# EAGLE design 8xEUCLID (EAGLE 9.4.1)
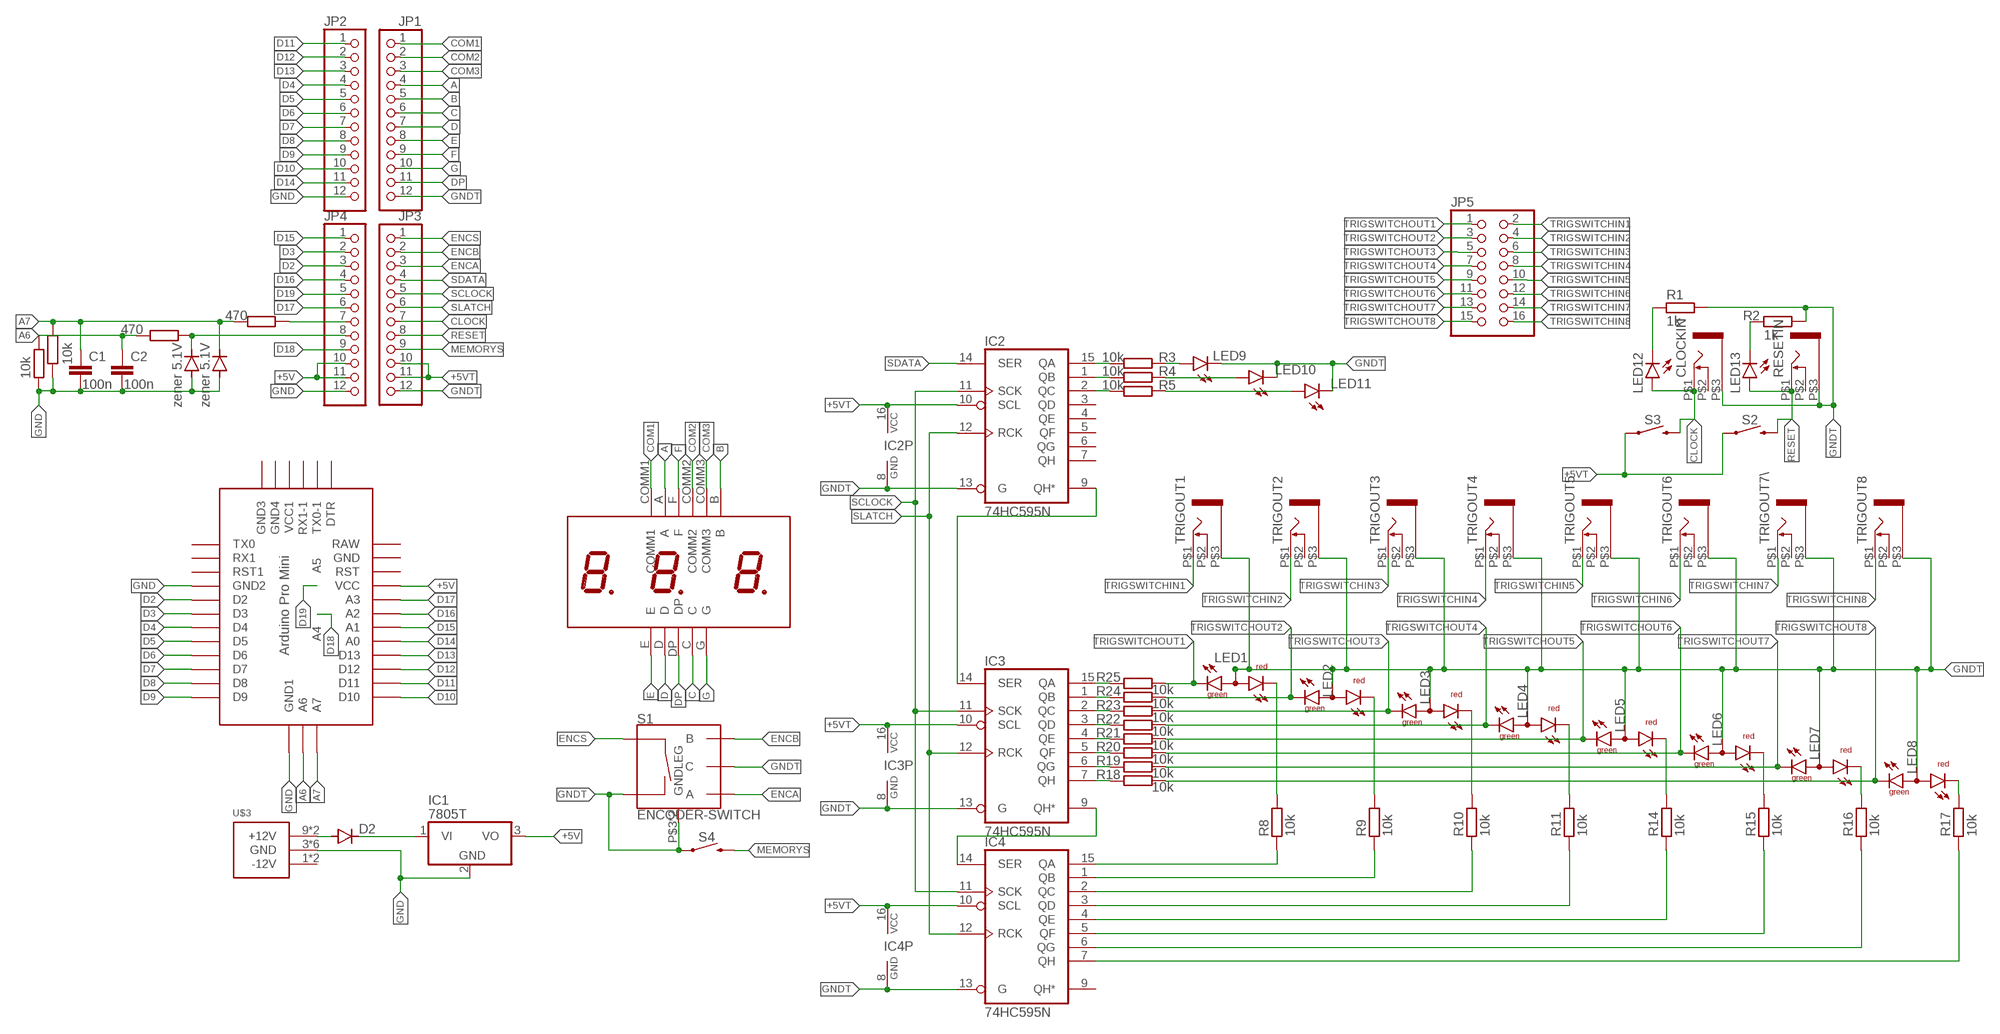
[diagram p0: schematic, sheet 1]

## Parts
C1  100n  C-EU025-025X050  [C025-025X050]
C2  100n  C-EU025-025X050  [C025-025X050]
CLOCKIN  WQP-PJ301M-12_JACK  [WQP-PJ301M-12_JACK]
D1  zener 5.1V  BAV21  [DO35-10]
D2  1N4004  [DO41-10]
D3  zener 5.1V  BAV21  [DO35-10]
IC1  7805T  [TO220H]
IC2  74HC595N  [DIL16]
IC3  74HC595N  [DIL16]
IC4  74HC595N  [DIL16]
JP1  PINHD-1X12-CB  [1X12-CB]
JP2  PINHD-1X12-CB  [1X12-CB]
JP3  PINHD-1X12-CB  [1X12-CB]
JP4  PINHD-1X12-CB  [1X12-CB]
JP5  PINHD-2X8  [2X08]
LED1  L-115WEGW-CA  [DUOLED-A-3MM]
LED2  L-115WEGW-CA  [DUOLED-A-3MM]
LED3  L-115WEGW-CA  [DUOLED-A-3MM]
LED4  L-115WEGW-CA  [DUOLED-A-3MM]
LED5  L-115WEGW-CA  [DUOLED-A-3MM]
LED6  L-115WEGW-CA  [DUOLED-A-3MM]
LED7  L-115WEGW-CA  [DUOLED-A-3MM]
LED8  L-115WEGW-CA  [DUOLED-A-3MM]
LED9  LED3MM  [LED3MM]
LED10  LED3MM  [LED3MM]
LED11  LED3MM  [LED3MM]
LED12  LED5MM  [LED5MM]
LED13  LED5MM  [LED5MM]
R1  1k  R-EU_0204/2V  [0204V]
R2  1k  R-EU_0204/2V  [0204V]
R3  10k  R-EU_0204/2V  [0204V]
R4  10k  R-EU_0204/2V  [0204V]
R5  10k  R-EU_0204/2V  [0204V]
R6  10k  R-EU_0204/7  [0204/7]
R7  10k  R-EU_0204/7  [0204/7]
R8  10k  R-EU_0204/2V  [0204V]
R9  10k  R-EU_0204/2V  [0204V]
R10  10k  R-EU_0204/2V  [0204V]
R11  10k  R-EU_0204/2V  [0204V]
R12  470  R-EU_0204/7  [0204/7]
R13  470  R-EU_0204/7  [0204/7]
R14  10k  R-EU_0204/2V  [0204V]
R15  10k  R-EU_0204/2V  [0204V]
R16  10k  R-EU_0204/2V  [0204V]
R17  10k  R-EU_0204/2V  [0204V]
R18  10k  R-EU_0204/2V  [0204V]
R19  10k  R-EU_0204/2V  [0204V]
R20  10k  R-EU_0204/2V  [0204V]
R21  10k  R-EU_0204/2V  [0204V]
R22  10k  R-EU_0204/2V  [0204V]
R23  10k  R-EU_0204/2V  [0204V]
R24  10k  R-EU_0204/2V  [0204V]
R25  10k  R-EU_0204/2V  [0204V]
RESETIN  WQP-PJ301M-12_JACK  [WQP-PJ301M-12_JACK]
S1  ENCODER-SWITCH  [ROTARY_ENC_PLAIN]
S2  MOMENTARY-SWITCH-SPST-PTH-6.0MM  [TACTILE_SWITCH_PTH_6.0MM]
S3  MOMENTARY-SWITCH-SPST-PTH-6.0MM  [TACTILE_SWITCH_PTH_6.0MM]
S4  MOMENTARY-SWITCH-SPST-PTH-6.0MM  [TACTILE_SWITCH_PTH_6.0MM]
TRIGOUT1  WQP-PJ301M-12_JACK  [WQP-PJ301M-12_JACK]
TRIGOUT2  WQP-PJ301M-12_JACK  [WQP-PJ301M-12_JACK]
TRIGOUT3  WQP-PJ301M-12_JACK  [WQP-PJ301M-12_JACK]
TRIGOUT4  WQP-PJ301M-12_JACK  [WQP-PJ301M-12_JACK]
TRIGOUT5  WQP-PJ301M-12_JACK  [WQP-PJ301M-12_JACK]
TRIGOUT6  WQP-PJ301M-12_JACK  [WQP-PJ301M-12_JACK]
TRIGOUT7\  WQP-PJ301M-12_JACK  [WQP-PJ301M-12_JACK]
TRIGOUT8  WQP-PJ301M-12_JACK  [WQP-PJ301M-12_JACK]
U$1  3DIGIT_SEVENSEGMENT  [3DIG_SEVSEG]
U$2  ABK-PRO-MINI  [ABK-PRO-MINI]
U$3  POWER_SIMPLE10  [POWER_10]

## Nets
+5V: IC1.3(VO) JP4.10 JP4.11 U$2.VCC
+5VT: IC2.10(SCL) IC2.16(VCC) IC3.10(SCL) IC3.16(VCC) IC4.10(SCL) IC4.16(VCC) JP3.10 JP3.11 S2.1 S3.1
A: JP1.4 U$1.A
A6: C2.1 R6.1 R12.2 U$2.A6
A7: C1.1 D3.C R7.1 R13.2 U$2.A7
B: JP1.5 U$1.B
C: JP1.6 U$1.C
CLOCK: CLOCKIN.P$1 JP3.7 LED12.A S3.3
COM1: JP1.1 U$1.COMM1
COM2: JP1.2 U$1.COMM2
COM3: JP1.3 U$1.COMM3
D: JP1.7 U$1.D
D2: JP4.3 U$2.D2
D3: JP4.2 U$2.D3
D4: JP2.4 U$2.D4
D5: JP2.5 U$2.D5
D6: JP2.6 U$2.D6
D7: JP2.7 U$2.D7
D8: JP2.8 U$2.D8
D9: JP2.9 U$2.D9
D10: JP2.10 U$2.D10
D11: JP2.1 U$2.D11
D12: JP2.2 U$2.D12
D13: JP2.3 U$2.D13
D14: JP2.11 U$2.A0
D15: JP4.1 U$2.A1
D16: JP4.4 U$2.A2
D17: JP4.6 U$2.A3
D18: JP4.9 U$2.A4
D19: JP4.5 U$2.A5
DP: JP1.11 U$1.DP
E: JP1.8 U$1.E
ENCA: JP3.3 S1.A
ENCB: JP3.2 S1.B
ENCS: JP3.1 S1.SW+
F: JP1.9 U$1.F
G: JP1.10 U$1.G
GND: C1.2 C2.2 D1.A D3.A IC1.2(GND) JP2.12 JP4.12 R6.2 R7.2 U$2.GND1(GND2) U$2.GND4(GND1) U$3.3(GND) U$3.4(GND) U$3.5(GND) U$3.6(GND) U$3.7(GND) U$3.8(GND)
GNDT: CLOCKIN.P$3 IC2.8(GND) IC2.13(G) IC3.8(GND) IC3.13(G) IC4.8(GND) IC4.13(G) JP1.12 JP3.12 LED1.2(A) LED2.2(A) LED3.2(A) LED4.2(A) LED5.2(A) LED6.2(A) LED7.2(A) LED8.2(A) LED9.K(C) LED10.K(C) LED11.K(C) R1.2 R2.2 RESETIN.P$3 S1.C S1.P$3(GNDLEG) S1.P$4(GNDLEG) S1.SW- S4.1 TRIGOUT1.P$3 TRIGOUT2.P$3 TRIGOUT3.P$3 TRIGOUT4.P$3 TRIGOUT5.P$3 TRIGOUT6.P$3 TRIGOUT7\.P$3 TRIGOUT8.P$3
MEMORYS: JP3.9 S4.3
N$1: IC2.9(QH*) IC3.14(SER)
N$2: IC3.9(QH*) IC4.14(SER)
N$3: JP4.7 R13.1
N$4: D1.C JP4.8 R12.1
N$5: D2.A U$3.9(+12V) U$3.10(+12V)
N$6: LED8.3(CR) R17.2
N$7: IC3.7(QH) R18.1
N$8: LED7.3(CR) R16.2
N$9: D2.C IC1.1(VI)
N$10: IC3.6(QG) R19.1
N$11: IC3.5(QF) R20.1
N$12: IC3.4(QE) R21.1
N$13: IC4.15(QA) R8.1
N$14: IC4.1(QB) R9.1
N$15: IC4.2(QC) R10.1
N$16: IC4.3(QD) R11.1
N$17: IC4.4(QE) R14.1
N$18: IC4.5(QF) R15.1
N$19: IC4.6(QG) R16.1
N$20: IC4.7(QH) R17.1
N$21: IC2.15(QA) R3.1
N$22: IC2.1(QB) R4.1
N$23: IC2.2(QC) R5.1
N$24: IC3.3(QD) R22.1
N$25: LED6.3(CR) R15.2
N$26: IC3.2(QC) R23.1
N$27: IC3.1(QB) R24.1
N$28: LED12.K(C) R1.1
N$29: IC3.15(QA) R25.1
N$37: LED13.K(C) R2.1
N$38: LED9.A R3.2
N$39: LED10.A R4.2
N$40: LED11.A R5.2
N$41: LED5.3(CR) R14.2
N$42: LED4.3(CR) R11.2
N$43: LED3.3(CR) R10.2
N$44: LED2.3(CR) R9.2
N$45: LED1.3(CR) R8.2
RESET: JP3.8 LED13.A RESETIN.P$1 S2.3
SCLOCK: IC2.11(SCK) IC3.11(SCK) IC4.11(SCK) JP3.5
SDATA: IC2.14(SER) JP3.4
SLATCH: IC2.12(RCK) IC3.12(RCK) IC4.12(RCK) JP3.6
TRIGSWITCHIN1: JP5.2 TRIGOUT1.P$1
TRIGSWITCHIN2: JP5.4 TRIGOUT2.P$1
TRIGSWITCHIN3: JP5.6 TRIGOUT3.P$1
TRIGSWITCHIN4: JP5.8 TRIGOUT4.P$1
TRIGSWITCHIN5: JP5.10 TRIGOUT5.P$1
TRIGSWITCHIN6: JP5.12 TRIGOUT6.P$1
TRIGSWITCHIN7: JP5.14 TRIGOUT7\.P$1
TRIGSWITCHIN8: JP5.16 TRIGOUT8.P$1
TRIGSWITCHOUT1: JP5.1 LED1.1(CG) R25.2
TRIGSWITCHOUT2: JP5.3 LED2.1(CG) R24.2
TRIGSWITCHOUT3: JP5.5 LED3.1(CG) R23.2
TRIGSWITCHOUT4: JP5.7 LED4.1(CG) R22.2
TRIGSWITCHOUT5: JP5.9 LED5.1(CG) R21.2
TRIGSWITCHOUT6: JP5.11 LED6.1(CG) R20.2
TRIGSWITCHOUT7: JP5.13 LED7.1(CG) R19.2
TRIGSWITCHOUT8: JP5.15 LED8.1(CG) R18.2
Unconnected: CLOCKIN.P$2 IC2.3(QD) IC2.4(QE) IC2.5(QF) IC2.6(QG) IC2.7(QH) IC4.9(QH*) RESETIN.P$2 TRIGOUT1.P$2 TRIGOUT2.P$2 TRIGOUT3.P$2 TRIGOUT4.P$2 TRIGOUT5.P$2 TRIGOUT6.P$2 TRIGOUT7\.P$2 TRIGOUT8.P$2 U$2.DTR U$2.GND U$2.GND2(GND3) U$2.GND3(GND4) U$2.RAW U$2.RST U$2.RST1 U$2.RX1 U$2.RX1-1 U$2.TX0 U$2.TX0-1 U$2.VCC1 U$3.1(-12V) U$3.2(-12V)

## Library data of the parts
C1 C2 = resistor:C-EU: CAPACITOR, European symbol
CLOCKIN RESETIN TRIGOUT1-TRIGOUT6 TRIGOUT7\ TRIGOUT8 = thonkiconn:WQP-PJ301M-12_JACK
D1 D3 = diode:BAV21: DIODE high-voltage general purpose diode
D2 = diode:1N4004: DIODE general purpose rectifier, 1 A
IC1 = adafruit:78*: Positive VOLTAGE REGULATOR Added bigger pads to the TO-92 package
IC2-IC4 = 74xx-eu:74*595: 8-bit SHIFT REGISTER, output latch
JP1-JP4 = adafruit:PINHD-1X12: PIN HEADER
JP5 = pinhead:PINHD-2X8: PIN HEADER
LED1-LED8 = led:L-115WEGW-CA: T-1(3mm) BI-COLOR INDICATOR LAMP Source: Kingbright .. 2_colour_led_.pdf
LED9-LED13 = led:LED: LED OSRAM: - CHIPLED LG R971, LG N971, LY N971, LG Q971, LY Q971, LO R971, LY R971 LH N974, LH R974 LS Q976, LO Q976, LY Q976 LO Q996 - Hyper CHIPLED LW Q18S LB Q993, LB Q99A, LB R99A - SideLED LS A670, LO A670, LY A670, LG A670, LP A670 LB A673, LV A673, LT A673, LW A673 LH A674 LY A675 LS A676, LA A676, LO A676, LY A676, LW A676 LS A679, LY A679, LG A679 - Hyper Micro SIDELED® LS Y876, LA Y876, LO Y876, LY Y876 LT Y87S - SmartLED LW L88C, LW L88S LB L89C, LB L89S, LG L890 LS L89K, LO L89K, LY L89K LS L896, LA L896, LO L896, LY L896 - TOPLED LS T670, LO T670, LY T670, LG T670, LP T670 LSG T670, LSP T670, LSY T670, LOP T670, LYG T670 LG T671, LOG T671, LSG T671 LB T673, LV T673, LT T673, LW T673 LH T674 LS T676, LA T676, LO T676, LY T676, LB T676, LH T676, LSB T676, LW T676 LB T67C, LV T67C, LT T67C, LS T67K, LO T67K, LY T67K, LW E67C LS E67B, LA E67B, LO E67B, LY E67B, LB E67C, LV E67C, LT E67C LW T67C LS T679, LY T679, LG T679 LS T770, LO T770, LY T770, LG T770, LP T770 LB T773, LV T773, LT T773, LW T773 LH T774 LS E675, LA E675, LY E675, LS T675 LS T776, LA T776, LO T776, LY T776, LB T776 LHGB T686 LT T68C, LB T68C - Hyper Mini TOPLED® LB M676 - Mini TOPLED Santana® LG M470 LS M47K, LO M47K, LY M47K Source: http://www.osram.convergy.de LUXEON: - LUMILED® LXK2-PW12-R00, LXK2-PW12-S00, LXK2-PW14-U00, LXK2-PW14-V00 LXK2-PM12-R00, LXK2-PM12-S00, LXK2-PM14-U00 LXK2-PE12-Q00, LXK2-PE12-R00, LXK2-PE12-S00, LXK2-PE14-T00, LXK2-PE14-U00 LXK2-PB12-K00, LXK2-PB12-L00, LXK2-PB12-M00, LXK2-PB14-N00, LXK2-PB14-P00, LXK2-PB14-Q00 LXK2-PR12-L00, LXK2-PR12-M00, LXK2-PR14-Q00, LXK2-PR14-R00 LXK2-PD12-Q00, LXK2-PD12-R00, LXK2-PD12-S00 LXK2-PH12-R00, LXK2-PH12-S00 LXK2-PL12-P00, LXK2-PL12-Q00, LXK2-PL12-R00 Source: www.luxeon.com KINGBRIGHT: KA-3528ASYC Source: www.kingbright.com
R1-R25 = resistor:R-EU_: RESISTOR, European symbol
S1 = encoders switches:ENCODER-SWITCH: Rotary Encoder w/ Select Switch Encoders rotate similarly to potentiometers, but they’re different from potentiometers in that an encoder has full rotation without limits. They output gray code so that you can tell how much and in which direction the encoder has been turned. This encoder includes a push-down select switch built into the shaft. SparkFun Products Rotary Encoder <https://www.sparkfun.com/products/9117> (COM-09117); SF_SKU: COM-09117
S2-S4 = SparkFun-Switches:MOMENTARY-SWITCH-SPST: Momentary Switch (Pushbutton) - SPST Normally-open (NO) SPST momentary switches (buttons, pushbuttons). Variants PTH-12MM - 12mm square, through-hole Momentary Pushbutton Switch - 12mm Square <https://www.sparkfun.com/products/9190> (COM-09190) PTH-6.0MM, PTH-6.0MM-KIT - 6.0mm square, through-hole Mini Pushbutton Switch <https://www.sparkfun.com/products/97> (COM-00097) KIT package intended for soldering kit's - only one side of pads' copper is exposed. PTH-RIGHT-ANGLE-KIT - Right-angle, through-hole Right Angle Tactile Button <https://www.sparkfun.com/products/10791> - Used on SparkFun BigTime Watch Kit <https://www.sparkfun.com/products/11734> SMD-12MM - 12mm square, surface-mount Tactile Button - SMD (12mm) <https://www.sparkfun.com/products/12993> (COM-12993) Used on SparkFun PicoBoard <https://www.sparkfun.com/products/11888> SMD-4.5MM - 4.5mm Square Trackball Switch Used on SparkFun Blackberry Trackballer Breakout <https://www.sparkfun.com/products/13169> SMD-4.6MMX2.8MM - 4.60mm x 2.80mm, surface mount Used on SparkFun SAMD21 Mini Breakout <https://www.sparkfun.com/products/13664> SMD-5.2MM, SMD-5.2-REDUNDANT - 5.2mm square, surface-mount Mini Pushbutton Switch - SMD <https://www.sparkfun.com/products/8720> (COM-08720) Used on Arduino Pro Mini <https://www.sparkfun.com/products/11114> REDUNDANT package connects both switch circuits together SMD-6.0X3.5MM - 6.0 x 3.5mm, surface mount Momentary Reset Switch SMD <https://www.sparkfun.com/products/8229> (COM-08229) SMD-6.2MM-TALL - 6.2mm square, surface mount Tactile Button - SMD (6mm) <https://www.sparkfun.com/products/12992> Used on SparkFun Digital Sandbox <https://www.sparkfun.com/products/12651> SMD-RIGHT-ANGLE - Right-angle, surface mount Used on SparkFun Block for Intel® Edison - Arduino <https://www.sparkfun.com/products/13036>; PROD_ID: SWCH-08441; SF_SKU: COM-00097
U$1 = led-7-segment:3DIGIT_SEVENSEGMENT
U$2 = Arduino-clone:ABK-PRO-MINI: ABK Pro-Mini Arduino Clone
U$3 = eurorack:POWER_SIMPLE

## Board
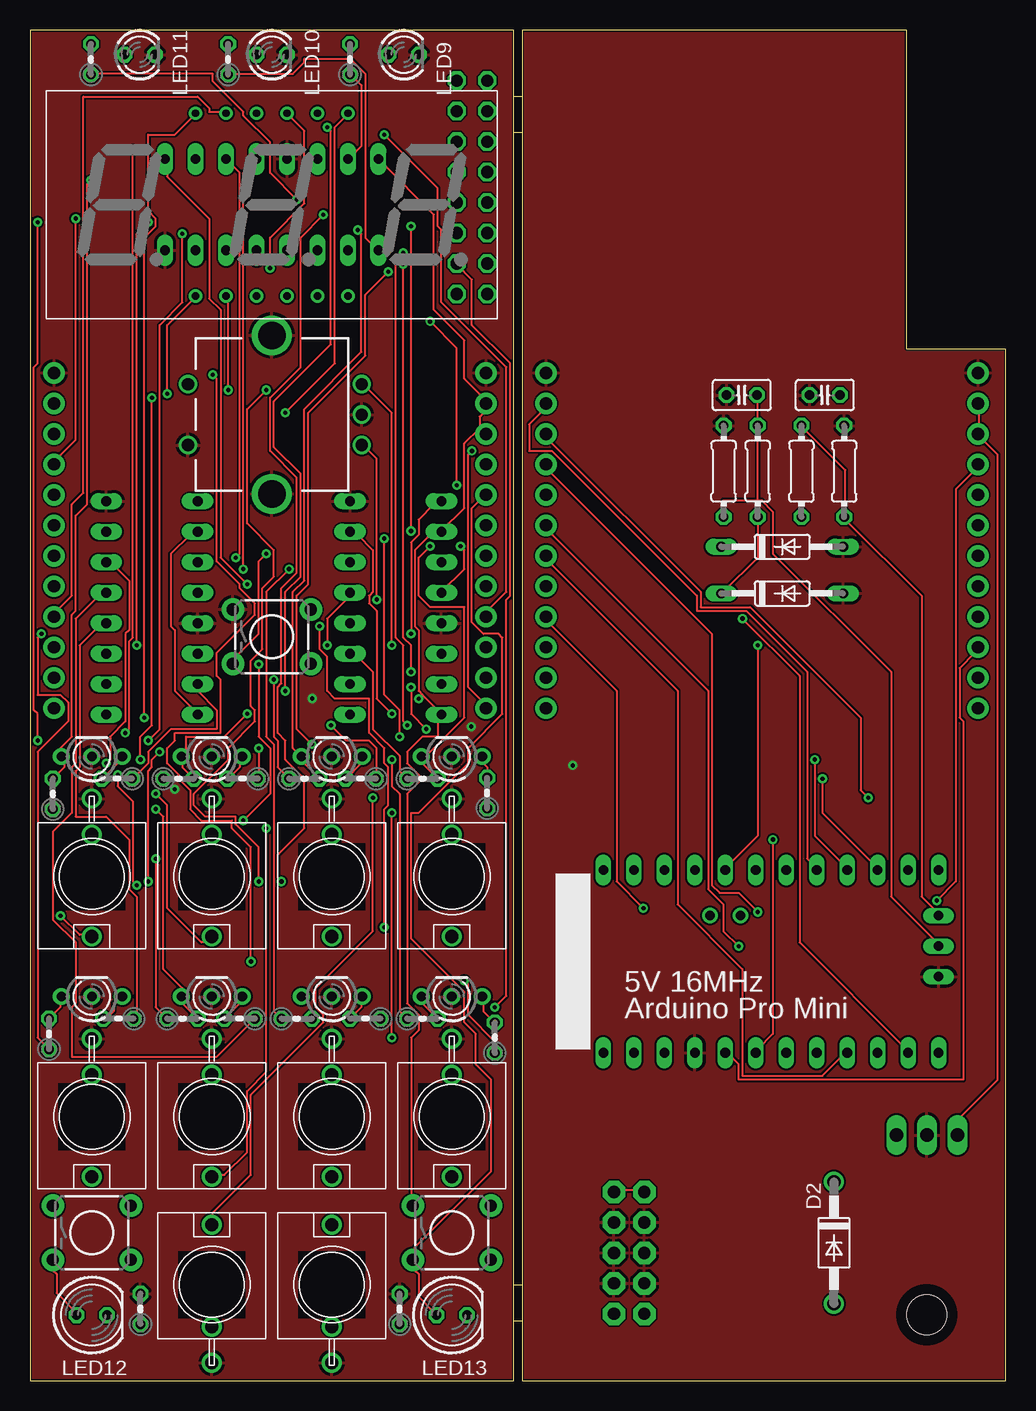
[diagram p1: board, top side]
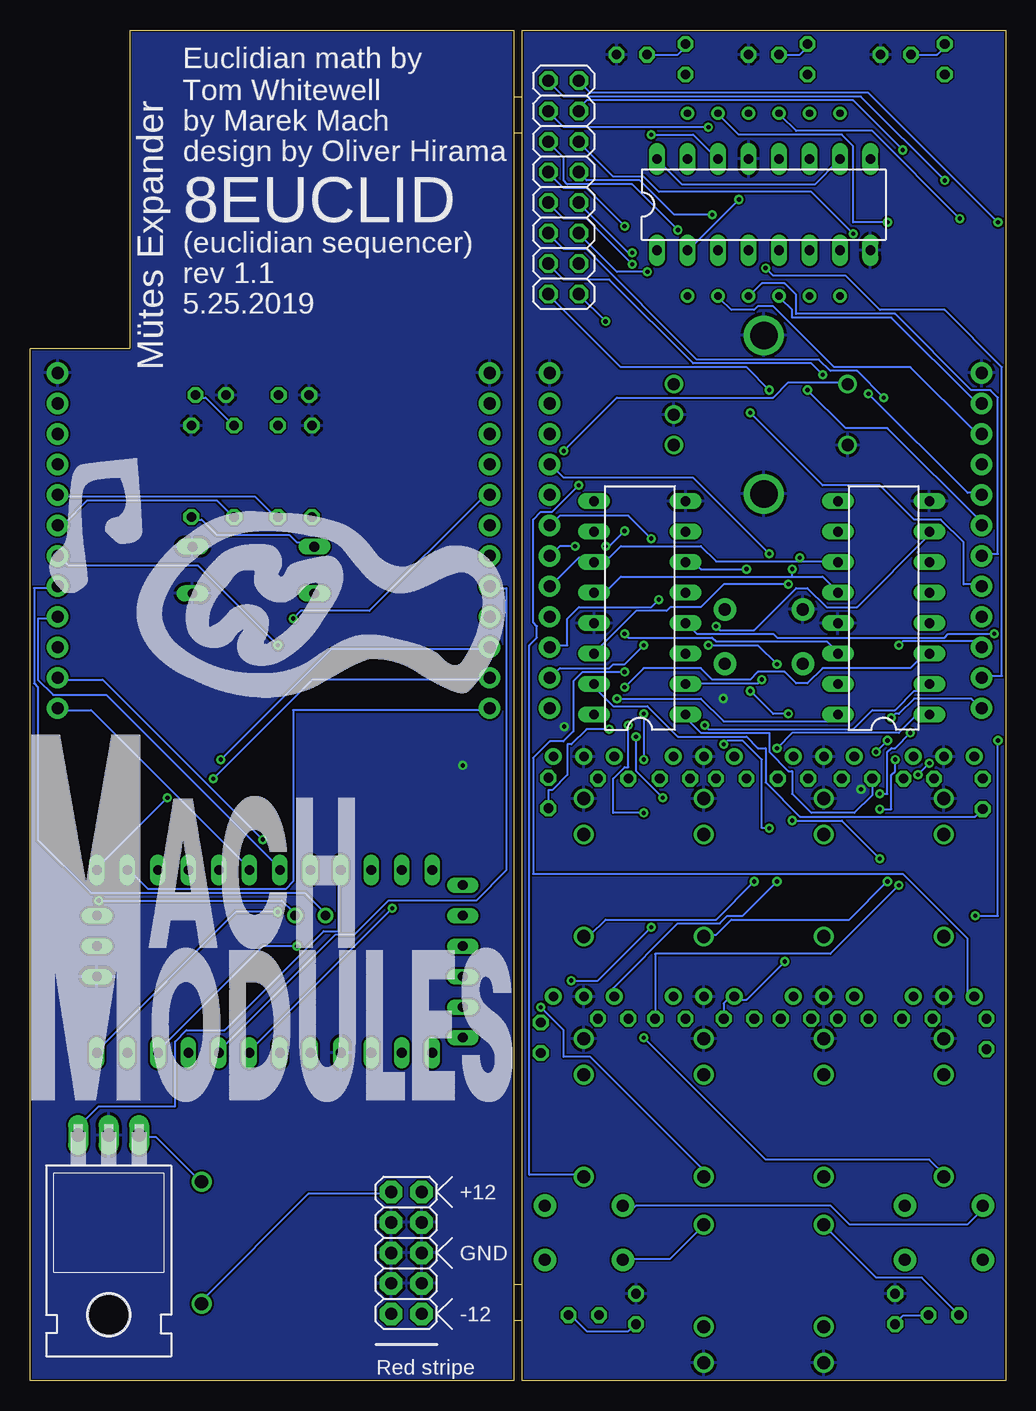
[diagram p2: board, bottom side, seen from below]

Size 81.3 x 112.55 mm. Coordinates in mm from the lower left corner, seen from the top.
Outline: 40.3,102.87 40.3,108.42
Outline: 40.3,3.5 40.3,9.04
Outline: 41,8.49 41,3.49
Outline: 41,108.19 41,103.19
Outline: 0,0 40.3,0 40.3,5 41,5 41,0 81.3,0 81.3,86 73,86 73,112.55 41,112.55 41,107 40.3,107 40.3,112.55 0,112.55 0,0
Outline: 40.3,8 40.3,104 41,104 41,8 40.3,8
Copper layers (1*16): Top 0.035mm / dielectric 0.15mm / Bottom 0.035mm
Design rules "default *": minimum track width 6mil, minimum drill 0.35mm, track to track 6mil, track to pad 6mil, pad to pad 6mil, via to via 6mil, smd to smd 6mil, copper to edge 6mil, drill to drill 6mil, minimum pad ring 10mil, minimum via ring 8mil, stop-mask expansion 4mil, vias tented up to drill 50mil, thermal gap 10mil

### Footprints (pad centres in the part's own frame; a part is rotated, then mirrored left to right if it is on the bottom)
C025-025X050 = drill 0.813 octagon: 1 -1.27,0; 2 1.27,0
WQP-PJ301M-12_JACK = drill 1.1: P$1 0,5; P$2 0,-3.5; P$3 0,-6.5
DO35-10 = drill 0.813 long: A 5.08,0; C -5.08,0
DO41-10 = drill 1.118: A 5.08,0; C -5.08,0
TO220H = drill 1.118 long: 1 -2.54,-10.16; 2 0,-10.16; 3 2.54,-10.16 | hole 3.302: 0,4.826
DIL16 = drill 0.813 long: 1 -8.89,-3.81; 2 -6.35,-3.81; 3 -3.81,-3.81; 4 -1.27,-3.81; 5 1.27,-3.81; 6 3.81,-3.81; 7 6.35,-3.81; 8 8.89,-3.81; 9 8.89,3.81; 10 6.35,3.81; 11 3.81,3.81; 12 1.27,3.81; 13 -1.27,3.81; 14 -3.81,3.81; 15 -6.35,3.81; 16 -8.89,3.81
1X12-CB = drill 1.016 pad 1.778: 1 -13.97,0; 2 -11.43,0; 3 -8.89,0; 4 -6.35,0; 5 -3.81,0; 6 -1.27,0; 7 1.27,0; 8 3.81,0; 9 6.35,0; 10 8.89,0; 11 11.43,0; 12 13.97,0
2X08 = drill 1.016 octagon: 1 -8.89,-1.27; 2 -8.89,1.27; 3 -6.35,-1.27; 4 -6.35,1.27; 5 -3.81,-1.27; 6 -3.81,1.27; 7 -1.27,-1.27; 8 -1.27,1.27; 9 1.27,-1.27; 10 1.27,1.27; 11 3.81,-1.27; 12 3.81,1.27; 13 6.35,-1.27; 14 6.35,1.27; 15 8.89,-1.27; 16 8.89,1.27
DUOLED-A-3MM = drill 0.8 pad 1.4: 1 -2.54,0; 2 0,0; 3 2.54,0
LED3MM = drill 0.813 octagon: A -1.27,0; K 1.27,0
LED5MM = drill 0.813 octagon: A -1.27,0; K 1.27,0
0204V = drill 0.813 octagon: 1 -1.27,0; 2 1.27,0
0204/7 = drill 0.813 octagon: 1 -3.81,0; 2 3.81,0
ROTARY_ENC_PLAIN = drill 1.016: A 7.493,-2.54; B 7.493,2.54; C 7.493,0; SW+ -6.985,2.54; SW- -6.985,-2.54 | drill 2.286: P$3 0,6.604; P$4 0,-6.604
TACTILE_SWITCH_PTH_6.0MM = drill 1.016 pad 1.88: 1 -3.251,2.261; 2 3.251,2.261; 3 -3.251,-2.261; 4 3.251,-2.261
3DIG_SEVSEG = drill 0.6: A -3.81,7.62; B 6.35,7.62; C 1.27,-7.62; COMM1 -6.35,7.62; COMM2 1.27,7.62; COMM3 3.81,7.62; D -3.81,-7.62; DP -1.27,-7.62; E -6.35,-7.62; F -1.27,7.62; G 3.81,-7.62; NC 6.35,-7.62
ABK-PRO-MINI = drill 0.8 long: A0 10.16,-11.43; A1 10.16,-8.89; A2 10.16,-6.35; A3 10.16,-3.81; A6 3.81,-21.59; A7 6.35,-21.59; D2 -5.08,-3.81; D3 -5.08,-6.35; D4 -5.08,-8.89; D5 -5.08,-11.43; D6 -5.08,-13.97; D7 -5.08,-16.51; D8 -5.08,-19.05; D9 -5.08,-21.59; D10 10.16,-21.59; D11 10.16,-19.05; D12 10.16,-16.51; D13 10.16,-13.97; DTR -3.81,8.89; GND 10.16,3.81; GND1 -5.08,-1.27; GND2 8.89,8.89; GND3 6.35,8.89; GND4 1.27,-21.59; RAW 10.16,6.35; RST 10.16,1.27; RST1 -5.08,1.27; RX1 -5.08,3.81; RX1-1 1.27,8.89; TX0 -5.08,6.35; TX0-1 -1.27,8.89; VCC 10.16,-1.27; VCC1 3.81,8.89 | drill 0.8: A4 6.35,-5.08; A5 6.35,-2.54
POWER_10 = drill 1.016 pad 1.88 octagon: 1 -5.08,-1.27; 2 -5.08,1.27; 3 -2.54,-1.27; 4 -2.54,1.27; 5 0,-1.27; 6 0,1.27; 7 2.54,-1.27; 8 2.54,1.27; 9 5.08,-1.27; 10 5.08,1.27

### Placement (x,y rotation side)
C1  66.23,82.13 180 top
C2  59.31,82.13 180 top
CLOCKIN  15.15,8 0 top
D1  62.68,65.6 0 top
D2  67,11.49 270 top
D3  62.68,69.49 0 top
IC1  74.74,10.3 180 bottom
IC2  20.15,98 0 bottom
IC3  30.48,64.39 90 bottom
IC4  10.16,64.39 90 bottom
JP1  2,70 90 top
JP2  43,70 90 top
JP3  38,70 90 top
JP4  79,70 90 top
JP5  36.83,99.44 270 bottom
LED1  5.15,52 0 top
LED2  15.15,52 0 top
LED3  25.15,52 0 top
LED4  35.15,52 0 top
LED5  5.15,32 0 top
LED6  15.15,32 0 top
LED7  25.15,32 0 top
LED8  35.15,32 0 top
LED9  31.15,110.5 0 top
LED10  20.15,110.5 0 top
LED11  9.15,110.5 0 top
LED12  5.15,5.46 0 top
LED13  35.15,5.46 0 top
R1  9.21,5.97 90 top
R2  30.8,5.97 90 top
R3  26.67,110.11 90 top
R4  16.51,110.11 90 top
R5  5.08,110.11 90 top
R6  57.8,75.78 90 top
R7  67.85,75.78 90 top
R8  7.24,50.16 180 top
R9  17.72,50.16 180 top
R10  27.56,50.16 180 top
R11  38.1,48.96 90 top
R12  60.64,75.78 90 top
R13  64.29,75.78 90 top
R14  7.37,30.16 180 top
R15  17.46,30.16 180 top
R16  27.94,30.16 180 top
R17  38.73,28.57 90 top
R18  32.7,30.16 0 top
R19  22.23,30.16 0 top
R20  12.7,30.16 0 top
R21  1.59,28.89 90 top
R22  32.7,50.16 0 top
R23  22.86,50.16 0 top
R24  12.38,50.16 0 top
R25  1.91,48.9 90 top
RESETIN  25.15,8 0 top
S1  20.15,80.5 0 top
S2  35.15,12.32 0 top
S3  5.15,12.32 0 top
S4  20.15,62 0 top
TRIGOUT1  5.15,42 180 top
TRIGOUT2  15.15,42 180 top
TRIGOUT3  25.15,42 180 top
TRIGOUT4  35.15,42 180 top
TRIGOUT5  5.15,22 180 top
TRIGOUT6  15.15,22 180 top
TRIGOUT7\  25.15,22 180 top
TRIGOUT8  35.15,22 180 top
U$1  20.15,98 0 top
U$2  54.13,32.4 90 top
U$3  49.93,10.64 90 bottom

### Tracks (layer width: path | path; a pad name or v marks a point on that pad's centre or on a via)
+5V
  Top 0.152: JP4.11 79.06,81.28 79.06,79.06 JP4.10 79.06,78.74 80.64,77.15 80.64,25.08 77.47,21.91 77.47,20.64 IC1.3
  Bottom 0.152: U$2.VCC 55.56,42.55 55.56,37.47 56.83,37.47 65.09,29.21 68.26,29.21 69.22,28.26 69.22,22.86 75.56,22.86 77.15,21.27 77.15,20.64 IC1.3
+5VT  (via drill 0.35)
  Top 0.152: IC4.16 13.97,55.56 12.06,57.47 12.06,62.55 11.75,62.87 11.75,68.9 13.34,70.48 13.97,70.48 IC4.10 | 37.47,79.38 37.78,79.06 JP3.10 37.47,79.38 | 37.47,79.38 37.47,80.33 37.78,80.64 37.78,81.28 JP3.11 37.78,81.6 37.78,81.92 36.2,83.5 36.2,86.68 33.66,89.22 33.66,97.16 29.21,101.6 IC2.16 | 32.7,57.15 32.38,57.47 32.38,62.55 32.07,62.87 32.07,69.22 33.34,70.48 34.29,70.48 IC3.10 34.29,70.8 36.2,72.71 36.2,78.11 37.47,79.38 | 32.7,57.15 33.97,55.88 | 33.97,55.88 34.29,55.56 IC3.16 33.97,55.88 | 32.7,57.15 v32.38,56.83 | 33.97,55.88 33.97,53.66 32.7,53.66 31.43,52.39 31.43,51.44 32.38,50.48 32.38,49.85 31.43,48.9 31.43,31.43 32.38,30.48 32.38,29.21 31.75,28.57 31.75,14.61 S2.1
  Bottom 0.152: S3.1 1.91,14.29 3.17,13.02 13.02,13.02 14.61,14.61 30.8,14.61 31.11,14.29 31.75,14.29 S2.1 | IC2.10 13.97,101.6 15.88,99.69 26.99,99.69 28.89,101.6 IC2.16 | v32.38,56.83 25.4,56.83 23.5,54.93 14.29,54.93 13.97,55.24 IC4.16
A
  Top 0.152: U$1.A 16.19,105.73 14.92,105.73 14.92,106.05 13.97,107 4.45,107 4.45,73.98 3.49,73.03 3.49,65.41 2.22,64.14 2.22,63.82 JP1.4
A6
  Top 0.152: C2.1 60.64,81.92 60.64,79.69 R12.2 60.64,79.38 60.64,73.34 | 60.64,73.34 57.78,73.34 57.78,72.07 R6.1 | 60.64,73.34 60.96,73.34 61.91,72.39 61.91,68.9 71.75,59.05 71.75,40.32 75.56,36.51 U$2.A6
A7
  Top 0.152: U$2.A7 75.56,39.05 74.3,40.32 74.3,65.41 67.94,71.75 R7.1 67.94,72.07 67.94,75.88 64.45,79.38 R13.2
  Bottom 0.152: R13.2 64.45,79.69 66.67,81.92 67.31,81.92 C1.1 | D3.C 57.78,69.53 58.1,69.85 59.05,69.85 59.69,70.48 65.72,70.48 66.99,71.75 67.63,71.75 R7.1
B  (via drill 0.35)
  Top 0.152: v21.27,80.64 25.4,84.77 25.4,104.46 26.35,105.41 U$1.B
  Bottom 0.152: v21.27,80.64 15.24,74.61 10.48,74.61 7.62,71.75 5.4,71.75 3.49,69.85 3.49,66.36 2.22,66.36 JP1.5
C
  Bottom 0.152: U$1.C 21.27,90.49 20.32,91.44 18.41,91.44 17.46,90.49 17.46,88.9 9.21,88.9 2.86,82.55 1.27,82.55 0.64,81.92 0.64,68.9 1.91,68.9 JP1.6
CLOCK  (via drill 0.35)
  Top 0.152: LED12.A 3.81,5.71 2.22,7.3 2.22,8.89 1.91,9.21 1.91,9.84 S3.3 | v29.53,70.17 29.53,57.15 30.8,55.88 v30.8,53.66 | v28.57,48.58 28.57,37.47 23.81,32.7 23.81,31.11 24.45,30.48 24.45,29.84 18.41,23.81 18.41,17.14 15.24,13.97 15.24,13.02 CLOCKIN.P$1
  Bottom 0.152: CLOCKIN.P$1 14.92,12.7 10.79,8.57 6.99,8.57 4.13,5.71 LED12.A | v29.53,70.17 31.43,72.07 37.15,72.07 37.78,71.44 JP3.7 | v30.8,53.66 30.8,50.8 v28.57,48.58
COM1  (via drill 0.35)
  Top 0.152: v9.53,55.24 9.53,95.25 10.48,96.2 10.48,96.84 9.84,97.47 9.84,103.82 12.06,103.82 13.65,105.41 U$1.COMM1
  Bottom 0.152: v9.53,55.24 9.21,55.56 8.89,55.56 7.62,56.83 2.86,56.83 2.22,56.2 JP1.1
COM2  (via drill 0.35)
  Top 0.152: v20,92.71 20,95.25 22.86,98.11 22.86,104.14 21.59,105.41 U$1.COMM2
  Bottom 0.152: v20,92.71 19.37,92.08 13.34,92.08 10.48,89.22 5.08,89.22 0.32,84.45 0.32,58.74 1.91,58.74 JP1.2
COM3  (via drill 0.35)
  Top 0.152: v9.84,96.52 8.89,95.57 v8.89,61.28
  Bottom 0.152: v9.84,96.52 12.7,96.52 12.7,102.87 13.65,103.82 22.23,103.82 23.81,105.41 U$1.COMM3 | v8.89,61.28 8.57,61.59 2.54,61.59 2.22,61.28 JP1.3
D  (via drill 0.35)
  Top 0.152: v16.51,82.55 16.51,90.17 U$1.D
  Bottom 0.152: v16.51,82.55 13.34,79.38 9.84,79.38 1.91,71.44 JP1.7
D2
  Top 0.152: U$2.D2 58.1,27.3 59.05,26.35 59.05,25.08 77.79,25.08 77.79,54.93 77.47,55.24 77.47,59.37 78.74,60.64 78.74,60.96 JP4.3
D3  (via drill 0.35)
  Top 0.152: v61.91,45.09 61.91,28.89 60.64,27.62 U$2.D3
  Bottom 0.152: v61.91,45.09 75.25,58.42 78.74,58.42 JP4.2
D4  (via drill 0.35)
  Top 0.152: v51.12,39.37 48.9,41.59 48.9,57.47 43.18,63.18 43.18,63.5 JP2.4
  Bottom 0.152: v51.12,39.37 62.87,27.62 U$2.D4
D5
  Bottom 0.152: U$2.D5 65.41,27.62 55.88,37.15 54.29,37.15 51.44,40.01 44.13,40.01 41.59,42.55 41.59,66.04 42.86,66.04 JP2.5
D6
  Top 0.152: U$2.D6 67.94,27.3 66.04,25.4 59.37,25.4 59.37,34.29 53.98,39.69 53.98,57.47 43.18,68.26 43.18,68.58 JP2.6
D7  (via drill 0.35)
  Top 0.152: v59.05,36.2 57.78,37.47 57.78,39.69 56.52,40.96 56.52,57.47 43.18,70.8 43.18,71.12 JP2.7
  Bottom 0.152: v59.05,36.2 61.91,36.2 70.48,27.62 U$2.D7
D8  (via drill 0.35)
  Top 0.152: v59.37,63.5 64.14,58.74 64.14,36.51 73.03,27.62 U$2.D8
  Bottom 0.152: v59.37,63.5 58.74,64.14 53.02,64.14 43.5,73.66 43.18,73.66 JP2.8
D9  (via drill 0.35)
  Top 0.152: v60.64,39.05 59.05,40.64 57.47,40.64 56.83,41.27 56.83,62.23 43.18,75.88 43.18,76.2 JP2.9
  Bottom 0.152: v60.64,39.05 64.14,39.05 75.56,27.62 U$2.D9
D10  (via drill 0.35)
  Top 0.152: v69.85,48.58 69.22,49.21 69.22,55.24 60.01,64.45 55.88,64.45 55.88,65.72 43.18,78.42 43.18,78.74 JP2.10
  Bottom 0.152: v69.85,48.58 75.56,42.86 U$2.D10
D11
  Bottom 0.152: U$2.D11 73.03,42.55 71.44,40.96 60.01,40.96 59.37,41.59 59.37,55.88 43.18,55.88 JP2.1
D12  (via drill 0.35)
  Top 0.152: v66.04,50.16 66.04,47.31 70.48,42.86 U$2.D12
  Bottom 0.152: v66.04,50.16 57.78,58.42 43.18,58.42 JP2.2
D13  (via drill 0.35)
  Top 0.152: v65.41,51.75 65.41,45.4 67.94,42.86 U$2.D13
  Bottom 0.152: v65.41,51.75 56.2,60.96 43.18,60.96 JP2.3
D14
  Top 0.152: U$2.A0 65.41,42.86 64.77,43.5 64.77,59.05 59.69,64.14 55.56,64.14 55.56,65.41 43.5,77.47 41.59,77.47 41.59,79.69 42.86,80.96 42.86,81.28 JP2.11
D15
  Bottom 0.152: U$2.A1 63.18,42.86 76.2,55.88 78.74,55.88 JP4.1
D16
  Bottom 0.152: U$2.A2 60.64,42.86 74.93,57.15 79.38,57.15 80.64,58.42 80.64,63.5 79.06,63.5 JP4.4
D17  (via drill 0.35)
  Top 0.152: v60.64,61.28 60.64,45.4 58.1,42.86 U$2.A3
  Bottom 0.152: v60.64,61.28 67.31,67.94 78.11,67.94 78.74,68.58 JP4.6
D18  (via drill 0.35)
  Top 0.152: v75.56,40.01 77.15,41.59 77.15,74.3 78.74,75.88 78.74,76.2 JP4.9
  Bottom 0.152: v75.56,40.01 60.33,40.01 59.37,39.05 U$2.A4
D19
  Bottom 0.152: U$2.A5 56.83,39.05 58.42,40.64 76.2,40.64 80.64,45.09 80.64,57.78 80.96,58.1 80.96,66.04 79.06,66.04 JP4.5
DP
  Bottom 0.152: U$1.DP 18.73,90.17 17.78,89.22 17.78,88.58 9.53,88.58 2.54,81.6 2.22,81.6 JP1.11
E  (via drill 0.35)
  Top 0.152: v11.43,82.23 11.43,87.95 13.65,90.17 U$1.E
  Bottom 0.152: v11.43,82.23 3.17,73.98 2.22,73.98 JP1.8
ENCA  (via drill 0.35)
  Top 0.152: v28.89,65.09 28.89,76.83 27.94,77.79 S1.A
  Bottom 0.152: v28.89,65.09 29.53,64.45 35.56,64.45 36.51,63.5 36.51,61.28 37.78,61.28 JP3.3
ENCB  (via drill 0.35)
  Top 0.152: v30.16,61.28 30.16,80.64 27.94,82.87 S1.B
  Bottom 0.152: v30.16,61.28 31.75,59.69 32.7,59.69 33.02,59.37 37.15,59.37 37.78,58.74 JP3.2
ENCS  (via drill 0.35)
  Top 0.152: v36.83,77.47 36.51,77.15 36.51,57.78 37.78,56.52 37.78,56.2 JP3.1
  Bottom 0.152: v36.83,77.47 32.38,81.92 19.37,81.92 18.1,83.19 13.34,83.19 S1.SW+
F  (via drill 0.35)
  Top 0.152: v3.81,96.84 3.81,78.42 2.22,76.83 2.22,76.52 JP1.9
  Bottom 0.152: v3.81,96.84 11.11,104.14 17.46,104.14 18.73,105.41 U$1.F
G
  Bottom 0.152: U$1.G 23.81,90.17 22.86,89.22 20.95,89.22 20.64,89.53 19.37,89.53 14.29,84.45 7.94,84.45 2.54,79.06 2.22,79.06 JP1.10
GND  (via drill 0.35)
  other vias: 45.23,51.27
  pour Top: 83.83,-1.27 40.96,-1.27 40.96,114.3 82.54,114.3
  pour Bottom: 40.96,-1.27 82.55,-1.27 82.55,114.3 40.96,114.3
GNDT  (via drill 0.35)
  other vias: 23.53,56.84 12.05,49.28 36.78,54.5
  pour Top: -1.27,114.3 40.32,114.3 40.32,-1.27 -1.27,-1.27
  pour Bottom: -1.27,114.3 40.32,114.3 40.32,-1.27 -1.27,-1.27
MEMORYS  (via drill 0.35)
  Top 0.152: v19.68,68.9 19.05,68.26 19.05,62.23 17.14,60.33 17.14,60.01 S4.3
  Bottom 0.152: v19.68,68.9 26.04,75.25 36.83,75.25 37.78,76.2 JP3.9
N$1  (via drill 0.35)
  Top 0.152: v18.1,66.36 15.88,68.58 15.88,89.22 14.92,90.17 14.92,96.84 11.43,100.33 11.43,101.6 IC2.9
  Bottom 0.152: v18.1,66.36 23.5,66.36 25.4,64.45 27.94,64.45 28.26,64.14 30.8,64.14 34.29,60.64 IC3.14
N$2  (via drill 0.35)
  Top 0.152: v31.75,62.23 31.75,69.85 32.38,70.48 32.38,71.75 33.66,73.03 34.29,73.03 IC3.9
  Bottom 0.152: v31.75,62.23 31.43,61.91 24.45,61.91 24.13,61.59 14.92,61.59 13.97,60.64 IC4.14
N$3
  Bottom 0.152: R13.1 64.45,72.07 65.72,73.34 76.52,73.34 78.42,71.44 78.74,71.44 JP4.7
N$4
  Top 0.152: D1.C 57.78,65.72 60.64,68.58 60.64,71.75 R12.1
  Bottom 0.152: JP4.8 78.74,73.66 62.55,73.66 60.96,72.07 60.64,72.07 R12.1
N$5
  Top 0.152: U$3.9 48.9,15.88 51.12,15.88 U$3.10
  Bottom 0.152: D2.A 66.99,6.67 58.1,15.56 51.44,15.56 U$3.10
N$6
  Top 0.152: R17.2 37.78,30.8 37.78,31.75 LED8.3
N$7  (via drill 0.35)
  Top 0.152: R18.1 30.8,30.8 30.8,48.9 30.16,49.53 v30.16,51.75 | v30.16,55.56 28.89,56.83 28.89,64.14 28.26,64.77 28.26,65.41 28.57,65.72 28.57,69.22 27.3,70.48 26.67,70.48 IC3.7
  Bottom 0.152: v30.16,55.56 v30.16,51.75
N$8
  Top 0.152: R16.2 27.62,31.11 27.62,31.75 LED7.3
N$9
  Bottom 0.152: D2.C 67.31,16.83 70.8,20.32 72.07,20.32 IC1.1
N$10  (via drill 0.35)
  Top 0.152: R19.1 20.32,30.8 20.32,53.02 19.68,53.66 19.68,65.72 v21.59,67.63
  Bottom 0.152: v21.59,67.63 25.4,67.63 25.72,67.94 26.67,67.94 IC3.6
N$11  (via drill 0.35)
  Top 0.152: R20.1 10.48,31.11 v10.48,43.5 | v17.78,46.67 20,48.9 20,52.7 19.05,53.66 v19.05,59.69 | v24.77,61.28 24.77,63.5 26.67,65.41 IC3.5
  Bottom 0.152: v10.48,43.5 13.65,46.67 v17.78,46.67 | v19.05,59.69 20.64,61.28 v24.77,61.28
N$12  (via drill 0.35)
  Top 0.152: R21.1 0.64,28.57 0.64,52.39 3.17,54.93 3.17,56.52 2.54,57.15 0.64,57.15 0.64,61.91 v0.95,62.23
  Bottom 0.152: v0.95,62.23 4.76,62.23 5.08,61.91 19.05,61.91 19.37,62.23 25.72,62.23 26.35,62.87 26.67,62.87 IC3.4
N$13
  Top 0.152: IC4.15 13.97,57.47 15.56,55.88 15.56,54.29 11.75,54.29 9.84,52.39 9.84,51.44 8.57,50.16 R8.1
N$14  (via drill 0.35)
  Top 0.152: v19.05,52.7 19.05,50.16 R9.1
  Bottom 0.152: v19.05,52.7 17.78,53.98 8.89,53.98 7.3,55.56 6.35,55.56 IC4.1
N$15  (via drill 0.35)
  Top 0.152: v25.08,54.61 26.35,53.34 28.26,53.34 28.89,52.7 28.89,50.16 R10.1
  Bottom 0.152: v25.08,54.61 24.77,54.29 12.7,54.29 11.11,55.88 9.21,55.88 7.62,57.47 6.67,57.47 6.35,57.78 IC4.2
N$16  (via drill 0.35)
  Top 0.152: v33.02,54.29 31.75,55.56 v31.75,57.78
  Bottom 0.152: R11.1 38.1,49.21 37.78,49.21 36.51,50.48 36.51,53.02 36.2,53.02 34.92,54.29 v33.02,54.29 | v31.75,57.78 30.16,59.37 25.4,59.37 24.45,58.42 21.27,58.42 20.64,59.05 18.41,59.05 17.46,58.1 16.51,58.1 15.24,59.37 7.94,59.37 6.99,60.33 6.35,60.33 IC4.3
N$17
  Top 0.152: R14.1 8.89,30.16 8.89,40.32 8.26,40.96 8.26,45.09 6.35,46.99 3.81,46.99 3.81,50.8 4.13,51.12 4.13,61.28 5.71,62.87 6.35,62.87 IC4.4
N$18
  Top 0.152: R15.1 15.56,26.99 3.49,26.99 3.49,31.11 3.81,31.43 3.81,36.51 1.91,38.42 1.91,45.72 3.49,47.31 3.49,51.12 3.81,51.44 3.81,63.5 5.71,65.41 6.35,65.41 IC4.5
N$19  (via drill 0.35)
  Top 0.152: v8.89,41.27 8.57,41.59 8.57,48.26 7.3,49.53 v7.3,50.48 | v6.35,51.44 6.67,51.75 6.67,53.66 7.94,54.93 7.94,62.23 8.26,62.55 8.26,66.67 6.99,67.94 6.35,67.94 IC4.6
  Bottom 0.152: R16.1 29.21,35.56 14.61,35.56 v8.89,41.27 | v6.35,51.44 v7.3,50.48
N$20  (via drill 0.35)
  Top 0.152: v24.13,62.87 24.13,60.96 24.77,60.33 24.77,57.47 25.4,56.83 28.26,56.83 28.26,53.98 29.53,52.7 29.53,51.44 29.84,51.12 29.84,47.94 29.53,47.62 v29.53,37.78 | v36.2,33.34 36.51,33.02 36.51,30.48 38.73,28.26 R17.1
  Bottom 0.152: v24.13,62.87 23.81,62.55 20.95,62.55 17.46,66.04 16.51,66.04 14.92,64.45 12.38,64.45 6.35,70.48 IC4.7 | v29.53,37.78 33.97,33.34 v36.2,33.34
N$21
  Top 0.152: IC2.15 26.67,101.92 27.62,102.87 27.62,107.95 26.67,108.9 R3.1
N$22
  Top 0.152: IC2.1 28.89,94.3 27.94,95.25 27.94,108.9 26.67,110.17 22.86,110.17 22.86,109.86 21.91,108.9 16.51,108.9 R4.1
N$23  (via drill 0.35)
  Top 0.152: v22.23,98.42 20,100.65 20,103.19 17.78,105.41 17.78,105.73 15.24,108.27 15.24,108.9 5.08,108.9 R5.1
  Bottom 0.152: v22.23,98.42 26.35,94.3 IC2.2
N$24
  Top 0.152: R22.1 30.8,50.8 30.8,52.07 28.57,54.29 28.57,59.05 27.3,60.33 26.67,60.33 IC3.3
N$25
  Top 0.152: R15.2 17.46,31.43 17.46,31.75 LED6.3
N$26  (via drill 0.35)
  Top 0.152: R23.1 20.64,51.12 20.64,53.34 20.32,53.66 v20.32,58.42
  Bottom 0.152: v20.32,58.42 20.64,58.1 26.67,58.1 IC3.2
N$27
  Bottom 0.152: IC3.1 26.67,55.24 25.4,53.98 19.68,53.98 19.68,52.39 18.1,50.8 17.78,50.8 17.78,48.9 16.19,47.31 12.6,47.31 11.11,48.79 R24.1
N$28
  Bottom 0.152: R1.1 9.21,4.76 8.57,5.4 6.67,5.4 LED12.K
N$29
  Bottom 0.152: R25.1 2.54,46.99 17.14,46.99 20,49.85 20,52.7 20.64,52.7 21.59,53.66 27.3,53.66 29.84,56.2 32.7,56.2 34.29,57.78 IC3.15
N$37
  Bottom 0.152: R2.1 31.11,4.45 31.43,4.13 34.92,4.13 36.2,5.4 LED13.K
N$38
  Bottom 0.152: R3.2 26.67,111.12 27.3,110.49 29.84,110.49 LED9.A
N$39
  Bottom 0.152: R4.2 16.51,111.12 17.14,110.49 18.73,110.49 LED10.A
N$40
  Bottom 0.152: R5.2 5.08,111.12 5.71,110.49 7.62,110.49 LED11.A
N$41
  Top 0.152: R14.2 6.35,30.16 6.99,30.8 6.99,31.43 7.62,32.07 LED5.3
N$42
  Top 0.152: R11.2 38.1,51.12 37.78,51.44 37.78,51.75 LED4.3
N$43
  Top 0.152: R10.2 26.35,50.16 27.62,51.44 27.62,51.75 LED3.3
N$44
  Top 0.152: R9.2 16.51,50.16 17.46,51.12 17.46,51.75 LED2.3
N$45
  Top 0.152: R8.2 6.03,50.16 7.62,51.75 LED1.3
RESET
  Top 0.152: LED13.A 33.66,5.71 32.38,6.99 32.38,8.89 32.07,9.21 32.07,9.84 S2.3 32.07,10.16 32.07,11.11 38.42,17.46 38.42,25.08 37.15,26.35 37.15,28.89 36.2,29.84 36.2,32.38 31.75,36.83 31.75,47.31 32.38,47.31 36.51,51.44 36.51,52.7 39.37,55.56 39.37,61.91 39.05,62.23 37.78,62.23 36.83,63.18 36.83,72.71 37.78,73.66 JP3.8
  Bottom 0.152: RESETIN.P$1 25.4,12.7 27.94,10.16 31.75,10.16 S2.3
SCLOCK  (via drill 0.35)
  Top 0.152: v17.14,68.58 17.46,68.9 17.46,100.65 16.51,101.6 IC2.11
  Bottom 0.152: 17.14,68.26 24.13,68.26 25.4,69.53 32.07,69.53 33.02,68.58 | 17.14,68.26 13.97,68.26 IC4.11 | 33.02,68.58 33.34,68.26 34.29,68.26 IC3.11 | 17.14,68.26 v17.14,68.58 | 33.02,68.58 35.56,68.58 37.78,66.36 JP3.5
SDATA  (via drill 0.35)
  Top 0.152: v29.53,103.82 33.97,99.38 33.97,96.2 34.29,95.89 34.29,89.85 39.69,84.45 39.69,65.72 38.1,64.14 38.1,63.82 JP3.4
  Bottom 0.152: v29.53,103.82 26.04,103.82 24.13,101.92 IC2.14
SLATCH  (via drill 0.35)
  Top 0.152: v17.78,67.63 17.78,100.65 18.73,101.6 IC2.12 | v35.88,69.53 36.2,69.22 36.2,67.63 34.29,65.72 IC3.12
  Bottom 0.152: 17.78,66.99 32.07,66.99 33.34,65.72 34.29,65.72 IC3.12 | 17.78,66.99 15.24,66.99 13.97,65.72 IC4.12 | 17.78,66.99 v17.78,67.63 | v35.88,69.53 37.15,69.53 37.78,68.9 JP3.6
TRIGSWITCHIN1  (via drill 0.35)
  Top 0.152: v0.64,96.52 0.64,84.77 0.32,84.45 0.32,55.88 0.64,55.56 v0.64,53.34 | v2.54,38.73 4.13,37.15 5.08,37.15 TRIGOUT1.P$1
  Bottom 0.152: v0.64,96.52 11.43,107.31 34.61,107.31 35.56,108.27 JP5.2 | v0.64,53.34 0.64,38.73 v2.54,38.73
TRIGSWITCHIN2  (via drill 0.35)
  Top 0.152: v8.57,102.55 8.57,61.91 8.26,61.59 8.26,54.29 v7.94,53.98 | v10.48,48.9 11.43,47.94 11.43,39.37 14.29,36.51 14.92,36.51 14.92,36.83 TRIGOUT2.P$1
  Bottom 0.152: v8.57,102.55 12.7,106.68 34.92,106.68 35.56,106.05 JP5.4 | v7.94,53.98 9.21,52.7 9.53,52.7 9.84,52.39 9.84,48.9 v10.48,48.9
TRIGSWITCHIN3  (via drill 0.35)
  Top 0.152: v12.7,95.57 12.7,89.85 10.79,87.95 10.79,54.29 v9.84,53.34 | v10.79,52.39 10.16,51.75 10.16,51.12 9.84,50.8 v9.84,41.59
  Bottom 0.152: v12.7,95.57 16.19,99.06 28.89,99.06 30.16,100.33 32.7,100.33 35.56,103.19 JP5.6 | v10.79,52.39 v9.84,53.34 | v9.84,41.59 13.02,38.42 22.86,38.42 24.13,37.15 25.08,37.15 TRIGOUT3.P$1
TRIGSWITCHIN4  (via drill 0.35)
  Top 0.152: v24.45,97.16 22.54,95.25 22.54,84.45 20,81.92 20,77.47 22.23,75.25 22.23,67.31 20.95,66.04 20.95,58.1 20.64,57.78 20.64,53.98 21.27,53.34 21.27,51.75 22.86,50.16 22.86,46.04 20.64,43.81 20.64,41.91 v20.95,41.59
  Bottom 0.152: v24.45,97.16 27.62,97.16 30.48,100.01 34.92,100.01 35.56,100.65 JP5.8 | v20.95,41.59 24.13,38.42 33.34,38.42 34.61,37.15 34.92,37.15 TRIGOUT4.P$1
TRIGSWITCHIN5  (via drill 0.35)
  Top 0.152: v31.11,93.98 30.48,93.34 30.48,61.91 31.11,61.28 31.11,54.93 v31.43,54.61 | v30.16,28.57 v30.16,47.31
  Bottom 0.152: v31.11,93.98 31.43,93.98 35.56,98.11 JP5.10 | v31.43,54.61 31.43,51.12 31.75,51.12 32.7,50.16 32.7,47.31 v30.16,47.31 | v30.16,28.57 20,18.41 6.35,18.41 5.08,17.14 TRIGOUT5.P$1
TRIGSWITCHIN6  (via drill 0.35)
  Top 0.152: v29.84,92.39 27.94,90.49 27.94,85.41 23.18,80.64 23.18,66.36 22.23,65.41 22.23,54.29 v23.5,53.02 | v19.68,46.04 19.68,25.72 18.1,24.13 18.1,19.05 16.19,17.14 15.24,17.14 TRIGOUT6.P$1
  Bottom 0.152: v29.84,92.39 32.38,92.39 35.56,95.57 JP5.12 | v23.5,53.02 23.18,53.34 21.91,53.34 20.32,51.75 20.32,46.04 v19.68,46.04
TRIGSWITCHIN7  (via drill 0.35)
  Top 0.152: v38.73,31.11 39.69,32.07 39.69,65.09 40.01,65.41 40.01,84.77 36.83,87.95 36.83,91.76 35.56,93.03 JP5.14
  Bottom 0.152: v38.73,31.11 36.83,29.21 36.83,26.99 34.61,26.99 25.4,17.78 25.4,17.14 TRIGOUT7\.P$1
TRIGSWITCHIN8  (via drill 0.35)
  Top 0.152: v33.34,88.27 35.56,86.04 v35.56,74.61
  Bottom 0.152: v33.34,88.27 35.56,90.49 JP5.16 | v35.56,74.61 37.78,72.39 38.73,72.39 39.37,71.75 39.37,63.18 39.05,62.87 39.05,61.91 39.69,61.28 39.69,17.14 35.24,17.14 TRIGOUT8.P$1
TRIGSWITCHOUT1  (via drill 0.35)
  Top 0.152: R25.2 2.86,51.12 2.86,51.75 LED1.1 2.54,52.07 2.54,52.7 3.49,53.66 3.49,63.82 3.81,64.14 3.81,72.07 4.76,73.03 4.76,99.69 v5.08,100.01
  Bottom 0.152: v5.08,100.01 12.06,107 36.83,107 38.1,108.27 JP5.1
TRIGSWITCHOUT2  (via drill 0.35)
  Top 0.152: R24.2 12.7,51.12 12.7,51.75 LED2.1 12.7,52.07 13.02,52.39 13.02,53.66 16.19,53.66 v18.1,55.56 | v24.77,104.46 25.08,104.14 25.08,86.36 20.32,81.6 20.32,77.79 22.54,75.56 22.54,66.99 21.27,65.72 v21.27,57.47
  Bottom 0.152: v24.77,104.46 36.83,104.46 38.1,105.73 JP5.3 | v21.27,57.47 19.37,55.56 v18.1,55.56
TRIGSWITCHOUT3  (via drill 0.35)
  Top 0.152: R23.2 22.86,51.44 22.86,51.75 LED3.1 22.54,52.07 21.91,52.7 21.91,65.72 22.86,66.67 22.86,80.96 27.62,85.72 27.62,95.57 v27.3,95.89
  Bottom 0.152: v27.3,95.89 31.11,99.69 36.51,99.69 36.83,100.01 36.83,101.92 38.1,103.19 JP5.5
TRIGSWITCHOUT4  (via drill 0.35)
  Top 0.152: R22.2 32.7,51.44 32.7,51.75 | v31.75,70.8 v31.75,96.2 | v33.34,69.53 32.38,68.58 32.38,65.41 33.34,64.45 36.2,64.45 36.2,55.24 32.7,51.75 | 32.7,51.75 LED4.1
  Bottom 0.152: v31.75,96.2 34.92,99.38 36.83,99.38 38.1,100.65 JP5.7 | v31.75,70.8 33.02,69.53 v33.34,69.53
TRIGSWITCHOUT5  (via drill 0.35)
  Top 0.152: R21.2 2.54,31.11 2.54,31.75 LED5.1 | v31.11,93.03 31.11,61.91 31.75,61.28 v31.75,59.05
  Bottom 0.152: v31.11,93.03 34.92,96.84 36.83,96.84 38.1,98.11 JP5.9 | v31.75,59.05 35.24,59.05 36.03,58.27 36.03,54.09 36.86,53.27 37.96,53.27 37.98,53.29 39.37,51.9 39.37,42.23 8.57,42.23 3.17,36.83 3.17,32.07 2.86,32.07 LED5.1
TRIGSWITCHOUT6  (via drill 0.35)
  Top 0.152: R20.2 12.7,31.43 12.7,31.75 LED6.1 12.7,32.07 12.7,32.7 11.11,34.29 11.11,46.99 v10.48,47.62 | v10.16,81.92 10.16,54.61 9.21,53.66 v9.21,51.75
  Bottom 0.152: v10.16,81.92 12.38,84.14 14.61,84.14 15.56,85.09 25.72,85.09 34.92,94.3 36.83,94.3 38.1,95.57 JP5.11 | v9.21,51.75 9.21,50.8 9.53,50.48 9.53,47.62 v10.48,47.62
TRIGSWITCHOUT7  (via drill 0.35)
  Top 0.152: v15.24,83.82 15.56,83.5 15.56,68.26 17.46,66.36 17.46,66.04 18.73,64.77 18.73,63.82 15.56,60.64 15.56,58.74 15.88,58.42 15.88,53.98 12.06,53.98 12.06,53.34 11.43,52.7 11.43,51.44 12.38,50.48 12.38,50.16 13.34,49.2 13.34,47.62 14.29,46.67 16.83,46.67 16.83,46.04 18.41,44.45 v18.41,34.92
  Bottom 0.152: R19.2 23.5,31.43 23.18,31.75 22.86,31.75 LED7.1 22.54,31.75 21.59,31.75 v18.41,34.92 | v15.24,83.82 16.19,84.77 26.04,84.77 33.02,91.76 36.83,91.76 38.1,93.03 JP5.13
TRIGSWITCHOUT8  (via drill 0.35)
  Top 0.152: R18.2 32.7,31.43 32.7,31.75 LED8.1 | v19.68,82.55 18.1,80.96 18.1,71.44 20.32,69.22 20.32,66.99 19.37,66.04 19.37,60.96 18.41,60.01 18.41,56.2 18.73,55.88 18.73,54.93 16.51,52.7 16.51,51.75 13.65,48.9 13.65,47.94 14.61,46.99 17.14,46.99 17.14,46.35 19.05,44.45 v19.05,41.59
  Bottom 0.152: v19.68,82.55 21.59,84.45 32.07,84.45 38.1,90.49 JP5.15 | v19.05,41.59 21.91,38.73 23.18,38.73 23.81,38.1 27.3,38.1 32.7,32.7 32.7,32.07 LED8.1

### Text on the board
bPlace: Euclidian math by / Tom Whitewell | rev 1.1 | 5.25.2019
tNames: 5V 16MHz | Arduino Pro Mini
bNames: Mütes Expander | by Marek Mach | design by Oliver Hirama | 8EUCLID | (euclidian sequencer)